# Altium schematic sheet NBP5 Actel ProASIC Plus PQ208 Rev1.01.SchDoc: Actel APA Daughter Board
size C; Organization: Altium Limited; Address1: L3, 12a Rodborough Rd; Address2: Frenchs Forest; Address3: NSW; Address4: Australia 2086; DocumentNumber: 1; Revision: 1.01; SheetNumber: 1; SheetTotal: 1
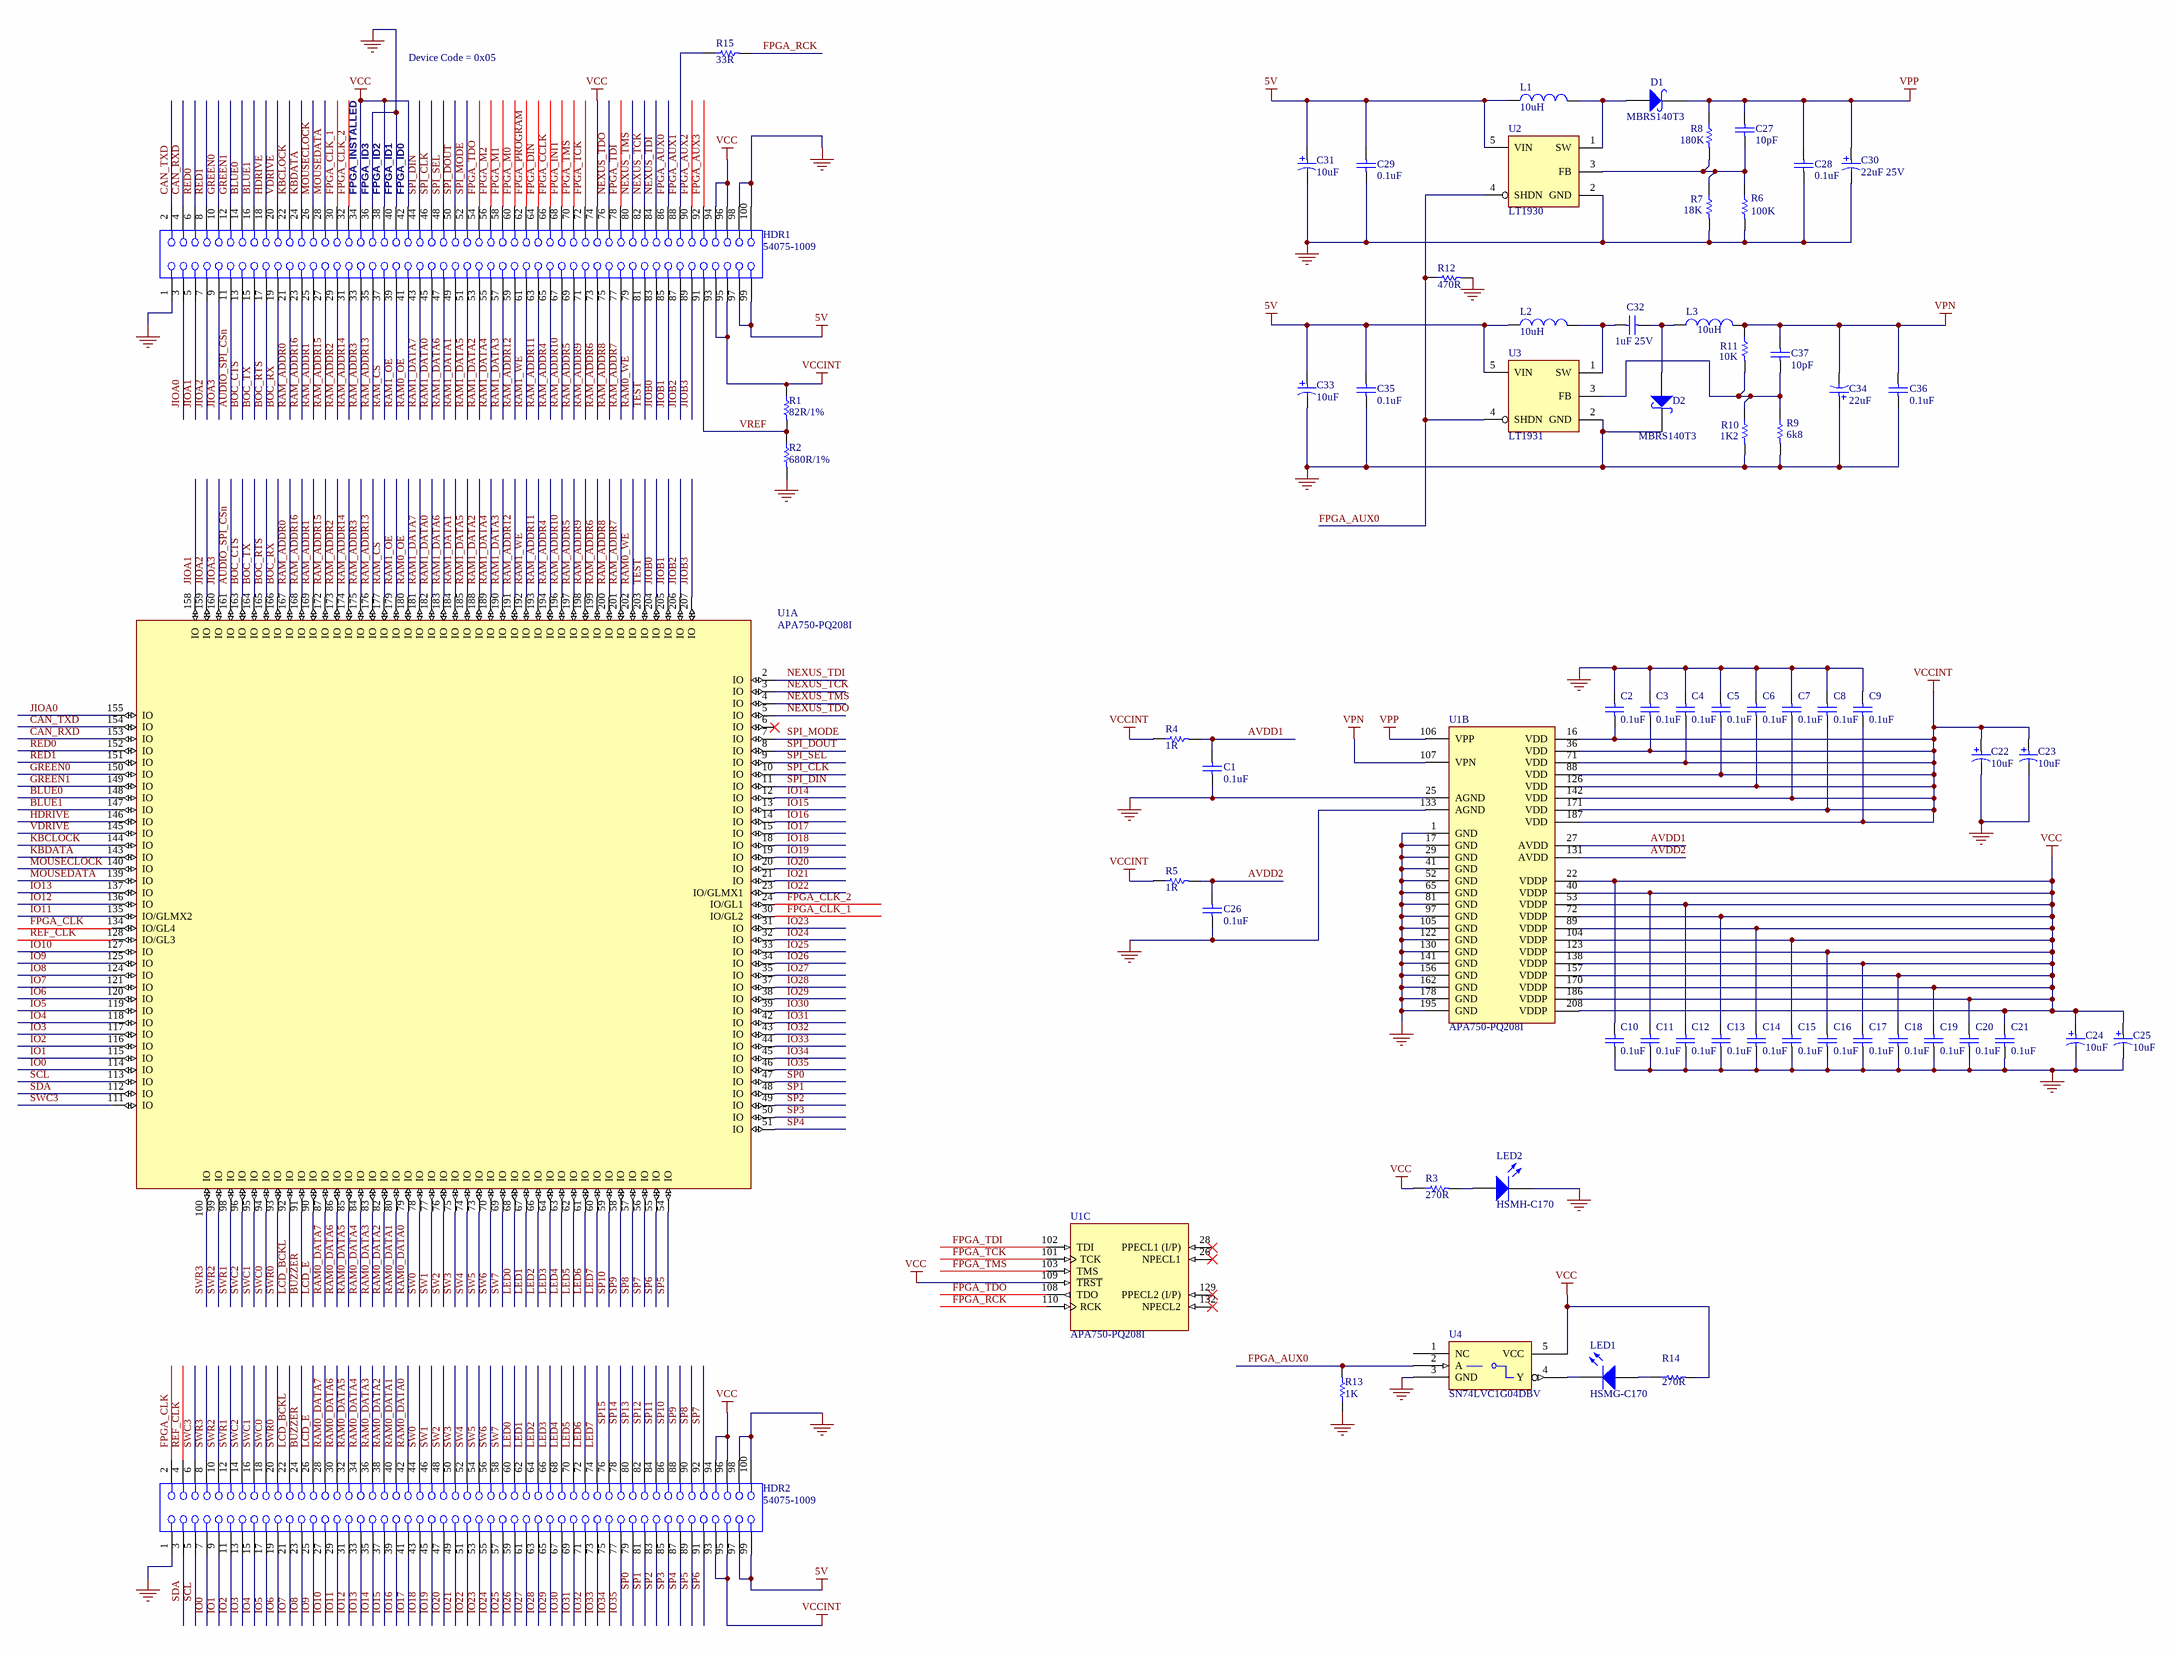
[diagram p0: NBP5 Actel ProASIC Plus PQ208 Rev1.01.SchDoc]

## Parts
C1  0.1uF  [CC2012-0805]
C2  0.1uF  [CC2012-0805]
C3  0.1uF  [CC2012-0805]
C4  0.1uF  [CC2012-0805]
C5  0.1uF  [CC2012-0805]
C6  0.1uF  [CC2012-0805]
C7  0.1uF  [CC2012-0805]
C8  0.1uF  [CC2012-0805]
C9  0.1uF  [CC2012-0805]
C10  0.1uF  [CC2012-0805]
C11  0.1uF  [CC2012-0805]
C12  0.1uF  [CC2012-0805]
C13  0.1uF  [CC2012-0805]
C14  0.1uF  [CC2012-0805]
C15  0.1uF  [CC2012-0805]
C16  0.1uF  [CC2012-0805]
C17  0.1uF  [CC2012-0805]
C18  0.1uF  [CC2012-0805]
C19  0.1uF  [CC2012-0805]
C20  0.1uF  [CC2012-0805]
C21  0.1uF  [CC2012-0805]
C22  10uF  [MCCT-B]
C23  10uF  [MCCT-B]
C24  10uF  [MCCT-B]
C25  10uF  [MCCT-B]
C26  0.1uF  [CC2012-0805]
C27  10pF  [CC2012-0805]
C28  0.1uF  [CC2012-0805]
C29  0.1uF  [CC2012-0805]
C30  22uF 25V  [MCCT-D]
C31  10uF  [MCCT-B]
C32  1uF 25V  [CC3216-1206]
C33  10uF  [MCCT-B]
C34  22uF  [MCCT-D]
C35  0.1uF  [CC2012-0805]
C36  0.1uF  [CC2012-0805]
C37  10pF  [CC2012-0805]
D1  MBRS140T3  [403A]
D2  MBRS140T3  [403A]
HDR1  54075-1009  [54075]
HDR2  54075-1009  [54075]
L1  10uH  [CC4532-1812]
L2  10uH  [CC4532-1812]
L3  10uH  [CC4532-1812]
LED1  HSMG-C170  [SMD _LED]
LED2  HSMH-C170  [SMD _LED]
R1  82R/1%  [CC2012-0805]
R2  680R/1%  [CC2012-0805]
R3  270R  [CC2012-0805]
R4  1R  [CC2012-0805]
R5  1R  [CC2012-0805]
R6  100K  [CC2012-0805]
R7  18K  [CC2012-0805]
R8  180K  [CC2012-0805]
R9  6k8  [CC2012-0805]
R10  1K2  [CC2012-0805]
R11  10K  [CC2012-0805]
R12  470R  [CC2012-0805]
R13  1K  [CC2012-0805]
R14  270R  [CC2012-0805]
R15  33R  [CC2012-0805]
U1  APA750-PQ208I  [PQ208]  (parts A,B,C of 3)
U2  LT1930  [SO-G5/P.95]
U3  LT1931  [SO-G5/P.95]
U4  SN74LVC1G04DBV  [SO-G5/P.95]

## Nets
5V: C29.1 C31.1 C33.1 C35.1 HDR1.97 HDR1.99 HDR2.97 HDR2.99 L1.1 L2.1 U2.5(VIN) U3.5(VIN)
GND: C1.2 C2.1 C3.1 C4.1 C5.1 C6.1 C7.1 C8.1 C9.1 C10.2 C11.1 C12.1 C13.1 C14.1 C15.1 C16.1 C17.1 C18.1 C19.1 C20.1 C21.1 C22.2 C23.2 C24.2 C25.2 C26.2 C28.2 C29.2 C30.2 C31.2 C33.2 C34.1 C35.2 C36.2 D2.2(K) HDR1.1 HDR1.36 HDR1.40 HDR1.98 HDR1.100 HDR2.1 HDR2.98 HDR2.100 LED2.2(K) R2.2 R6.2 R7.2 R9.2 R10.2 R12.2 R13.1 U1.1(GND) U1.17(GND) U1.25(AGND) U1.29(GND) U1.41(GND) U1.52(GND) U1.65(GND) U1.81(GND) U1.97(GND) U1.105(GND) U1.122(GND) U1.130(GND) U1.133(AGND) U1.141(GND) U1.156(GND) U1.162(GND) U1.178(GND) U1.195(GND) U2.2(GND) U3.2(GND) U4.3(GND)
VCC: C10.1 C11.2 C12.2 C13.2 C14.2 C15.2 C16.2 C17.2 C18.2 C19.2 C20.2 C21.2 C24.1 C25.1 HDR1.34 HDR1.38 HDR1.42 HDR1.74 HDR1.94 HDR1.96 HDR2.94 HDR2.96 R3.1 R14.2 U1.22(VDDP) U1.40(VDDP) U1.53(VDDP) U1.72(VDDP) U1.89(VDDP) U1.104(VDDP) U1.109(~{TRST}) U1.123(VDDP) U1.138(VDDP) U1.157(VDDP) U1.170(VDDP) U1.186(VDDP) U1.208(VDDP) U4.5(VCC)
VCCINT: C2.2 C3.2 C4.2 C5.2 C6.2 C7.2 C8.2 C9.2 C22.1 C23.1 HDR1.93 HDR1.95 HDR2.93 HDR2.95 R1.1 R4.1 R5.1 U1.16(VDD) U1.36(VDD) U1.71(VDD) U1.88(VDD) U1.126(VDD) U1.142(VDD) U1.171(VDD) U1.187(VDD)
VPN: C34.2 C36.1 C37.1 L3.2 R11.1 U1.107(VPN)
VPP: C27.1 C28.1 C30.1 D1.2(K) R8.1 U1.106(VPP)
AUDIO_SPI_CSn: HDR1.11 U1.161(IO)
AVDD1: C1.1 R4.2 U1.27(AVDD)
AVDD2: C26.1 R5.2 U1.131(AVDD)
BLUE0: HDR1.14 U1.148(IO)
BLUE1: HDR1.16 U1.147(IO)
BOC_CTS: HDR1.13 U1.163(IO)
BOC_RTS: HDR1.17 U1.165(IO)
BOC_RX: HDR1.19 U1.166(IO)
BOC_TX: HDR1.15 U1.164(IO)
BUZZER: HDR2.24 U1.91(IO)
CAN_RXD: HDR1.4 U1.153(IO)
CAN_TXD: HDR1.2 U1.154(IO)
FPGA_AUX0: HDR1.86 R12.1 R13.2 U2.4(SHDN) U3.4(SHDN) U4.2(A)
FPGA_AUX1: HDR1.88 R15.1
FPGA_AUX2: HDR1.90
FPGA_AUX3: HDR1.92
FPGA_CCLK: HDR1.66
FPGA_CLK: HDR2.2 U1.134(IO/GL4)
FPGA_CLK_1: HDR1.30 U1.30(IO/GL2)
FPGA_CLK_2: HDR1.32 U1.24(IO/GL1)
FPGA_DIN: HDR1.64
FPGA_INIT: HDR1.68
FPGA_M0: HDR1.60
FPGA_M1: HDR1.58
FPGA_M2: HDR1.56
FPGA_PROGRAM: HDR1.62
FPGA_RCK: R15.2 U1.110(RCK)
FPGA_TCK: HDR1.72 U1.101(TCK)
FPGA_TDI: HDR1.78 U1.102(TDI)
FPGA_TDO: HDR1.54 U1.108(TDO)
FPGA_TMS: HDR1.70 U1.103(TMS)
GREEN0: HDR1.10 U1.150(IO)
GREEN1: HDR1.12 U1.149(IO)
HDRIVE: HDR1.18 U1.146(IO)
IO0: HDR2.7 U1.114(IO)
IO1: HDR2.9 U1.115(IO)
IO2: HDR2.11 U1.116(IO)
IO3: HDR2.13 U1.117(IO)
IO4: HDR2.15 U1.118(IO)
IO5: HDR2.17 U1.119(IO)
IO6: HDR2.19 U1.120(IO)
IO7: HDR2.21 U1.121(IO)
IO8: HDR2.23 U1.124(IO)
IO9: HDR2.25 U1.125(IO)
IO10: HDR2.27 U1.127(IO)
IO11: HDR2.29 U1.135(IO/GLMX2)
IO12: HDR2.31 U1.136(IO)
IO13: HDR2.33 U1.137(IO)
IO14: HDR2.35 U1.12(IO)
IO15: HDR2.37 U1.13(IO)
IO16: HDR2.39 U1.14(IO)
IO17: HDR2.41 U1.15(IO)
IO18: HDR2.43 U1.18(IO)
IO19: HDR2.45 U1.19(IO)
IO20: HDR2.47 U1.20(IO)
IO21: HDR2.49 U1.21(IO)
IO22: HDR2.51 U1.23(IO/GLMX1)
IO23: HDR2.53 U1.31(IO)
IO24: HDR2.55 U1.32(IO)
IO25: HDR2.57 U1.33(IO)
IO26: HDR2.59 U1.34(IO)
IO27: HDR2.61 U1.35(IO)
IO28: HDR2.63 U1.37(IO)
IO29: HDR2.65 U1.38(IO)
IO30: HDR2.67 U1.39(IO)
IO31: HDR2.69 U1.42(IO)
IO32: HDR2.71 U1.43(IO)
IO33: HDR2.73 U1.44(IO)
IO34: HDR2.75 U1.45(IO)
IO35: HDR2.77 U1.46(IO)
JIOA0: HDR1.3 U1.155(IO)
JIOA1: HDR1.5 U1.158(IO)
JIOA2: HDR1.7 U1.159(IO)
JIOA3: HDR1.9 U1.160(IO)
JIOB0: HDR1.83 U1.204(IO)
JIOB1: HDR1.85 U1.205(IO)
JIOB2: HDR1.87 U1.206(IO)
JIOB3: HDR1.89 U1.207(IO)
KBCLOCK: HDR1.22 U1.144(IO)
KBDATA: HDR1.24 U1.143(IO)
LCD_BCKL: HDR2.22 U1.92(IO)
LCD_E: HDR2.26 U1.90(IO)
LED0: HDR2.60 U1.68(IO)
LED1: HDR2.62 U1.67(IO)
LED2: HDR2.64 U1.66(IO)
LED3: HDR2.66 U1.64(IO)
LED4: HDR2.68 U1.63(IO)
LED5: HDR2.70 U1.62(IO)
LED6: HDR2.72 U1.61(IO)
LED7: HDR2.74 U1.60(IO)
MOUSECLOCK: HDR1.26 U1.140(IO)
MOUSEDATA: HDR1.28 U1.139(IO)
NEXUS_TCK: HDR1.82 U1.3(IO)
NEXUS_TDI: HDR1.84 U1.2(IO)
NEXUS_TDO: HDR1.76 U1.5(IO)
NEXUS_TMS: HDR1.80 U1.4(IO)
RAM0_DATA0: HDR2.42 U1.79(IO)
RAM0_DATA1: HDR2.40 U1.80(IO)
RAM0_DATA2: HDR2.38 U1.82(IO)
RAM0_DATA3: HDR2.36 U1.83(IO)
RAM0_DATA4: HDR2.34 U1.84(IO)
RAM0_DATA5: HDR2.32 U1.85(IO)
RAM0_DATA6: HDR2.30 U1.86(IO)
RAM0_DATA7: HDR2.28 U1.87(IO)
RAM0_OE: HDR1.41 U1.180(IO)
RAM0_WE: HDR1.79 U1.202(IO)
RAM1_DATA0: HDR1.45 U1.182(IO)
RAM1_DATA1: HDR1.49 U1.184(IO)
RAM1_DATA2: HDR1.53 U1.188(IO)
RAM1_DATA3: HDR1.57 U1.190(IO)
RAM1_DATA4: HDR1.55 U1.189(IO)
RAM1_DATA5: HDR1.51 U1.185(IO)
RAM1_DATA6: HDR1.47 U1.183(IO)
RAM1_DATA7: HDR1.43 U1.181(IO)
RAM1_OE: HDR1.39 U1.179(IO)
RAM1_WE: HDR1.61 U1.192(IO)
RAM_ADDR0: HDR1.21 U1.167(IO)
RAM_ADDR1: HDR1.25 U1.169(IO)
RAM_ADDR2: HDR1.29 U1.173(IO)
RAM_ADDR3: HDR1.33 U1.175(IO)
RAM_ADDR4: HDR1.65 U1.194(IO)
RAM_ADDR5: HDR1.69 U1.197(IO)
RAM_ADDR6: HDR1.73 U1.199(IO)
RAM_ADDR7: HDR1.77 U1.201(IO)
RAM_ADDR8: HDR1.75 U1.200(IO)
RAM_ADDR9: HDR1.71 U1.198(IO)
RAM_ADDR10: HDR1.67 U1.196(IO)
RAM_ADDR11: HDR1.63 U1.193(IO)
RAM_ADDR12: HDR1.59 U1.191(IO)
RAM_ADDR13: HDR1.35 U1.176(IO)
RAM_ADDR14: HDR1.31 U1.174(IO)
RAM_ADDR15: HDR1.27 U1.172(IO)
RAM_ADDR16: HDR1.23 U1.168(IO)
RAM_CS: HDR1.37 U1.177(IO)
RED0: HDR1.6 U1.152(IO)
RED1: HDR1.8 U1.151(IO)
REF_CLK: HDR2.4 U1.128(IO/GL3)
SCL: HDR2.5 U1.113(IO)
SDA: HDR2.3 U1.112(IO)
SP0: HDR2.79 U1.47(IO)
SP1: HDR2.81 U1.48(IO)
SP2: HDR2.83 U1.49(IO)
SP3: HDR2.85 U1.50(IO)
SP4: HDR2.87 U1.51(IO)
SP5: HDR2.89 U1.54(IO)
SP6: HDR2.91 U1.55(IO)
SP7: HDR2.92 U1.56(IO)
SP8: HDR2.90 U1.57(IO)
SP9: HDR2.88 U1.58(IO)
SP10: HDR2.86 U1.59(IO)
SP11: HDR2.84
SP12: HDR2.82
SP13: HDR2.80
SP14: HDR2.78
SP15: HDR2.76
SPI_CLK: HDR1.46 U1.10(IO)
SPI_DIN: HDR1.44 U1.11(IO)
SPI_DOUT: HDR1.50 U1.8(IO)
SPI_MODE: HDR1.52 U1.7(IO)
SPI_SEL: HDR1.48 U1.9(IO)
SW0: HDR2.44 U1.78(IO)
SW1: HDR2.46 U1.77(IO)
SW2: HDR2.48 U1.76(IO)
SW3: HDR2.50 U1.75(IO)
SW4: HDR2.52 U1.74(IO)
SW5: HDR2.54 U1.73(IO)
SW6: HDR2.56 U1.70(IO)
SW7: HDR2.58 U1.69(IO)
SWC0: HDR2.18 U1.94(IO)
SWC1: HDR2.16 U1.95(IO)
SWC2: HDR2.14 U1.96(IO)
SWC3: HDR2.6 U1.111(IO)
SWR0: HDR2.20 U1.93(IO)
SWR1: HDR2.12 U1.98(IO)
SWR2: HDR2.10 U1.99(IO)
SWR3: HDR2.8 U1.100(IO)
TEST: HDR1.81 U1.203(IO)
VDRIVE: HDR1.20 U1.145(IO)
VREF: HDR1.91 R1.2 R2.1
NetC27_2: C27.2 R6.1 R7.1 R8.2 U2.3(FB)
NetC32_1: C32.1 L2.2 U3.1(SW)
NetC32_2: C32.2 D2.1(A) L3.1
NetC37_2: C37.2 R9.1 R10.1 R11.2 U3.3(FB)
NetD1_1: D1.1(A) L1.2 U2.1(SW)
NetLED1_1: LED1.1(A) R14.1
NetLED1_2: LED1.2(K) U4.4(Y)
NetLED2_1: LED2.1(A) R3.2

Not connected (* = marked no-connect by the designer): U1 6(IO)* 26(NPECL1)* 28(PPECL1_(I/P))* 129(PPECL2_(I/P))* 132(NPECL2)*; U4 1(NC)

## Notes on the sheet
- Device Code = 0x05
- (near HDR1) FPGA_INSTALLED
- (near HDR1) FPGA_ID3
- (near HDR1) FPGA_ID2
- (near HDR1) FPGA_ID1
- (near HDR1) FPGA_ID0
- Title
- Size:
- Date:
- File:
- C
- Number:
- Time:
- Revision:
- Sheet
- of

## Library data of the parts
C1-C21 C26-C29 C32 C35-C37 = CAP: Capacitor
C22-C25 C30 C31 C33 C34 = CAP_POLAR: Polar Capacitor
  C30 C31 C33 C34: Supplier Code: FARNELL 197520
D1 D2 = Shottky: Shottky Diode
HDR1 HDR2 = 54075-1009: Board-to-Board, Docking Station, 0.80mm (.031") Pitch, Shielded Receptacle, Vertical, Ultra Low Profile, SMT; Manufacturer: Molex; Package Information: Latest Revision: Jun-2001; Mating Height: 8.5mm; Voltage: 100V; Current: 0.5A; Contact Resistance: 40mOhm max; PCB Layout: Complies with Manufacturer's Recommendation.; Published: 15-Oct-2003; Datasheet: Latest Revision: Feb-2002; Package Reference: 54075; Publisher: Altium Limited
L1-L3 = INDUCTOR
LED1 LED2 = HSMX-C670: Typical RED GaAs SMD LED Agilent make; Manufacturer: Generic Components; Class I: Optoelectronic; Fitted: True; Published: 8-Jun-2000; Revision: July-2002: Re-released for DXP Platform.; Publisher: Altium Limited; Class II: LED
R1-R15 = RES: Resistor
U1 = APA750-PQ208I: ProASICPlus APA750 Flash FPGA, 156 User IOs, 208-Pin PQFP, Speed Grade Standard, Industrial Grade; Package Information: Latest Revision: ver8.2, Jun-2003; PECL Pins: If unused, leave unconnected.; Code - JEDEC: MS-029-FA-1; Published: 21-May-2003; Datasheet: Latest Revision: Oct-2003; Package Reference: PQ208; Publisher: Altium Limited
U2 = LT1930: Switching Regulator; Manufacturer: Linear Technology
U3 = LT1931: Switching Regulator; Manufacturer: Linear Technology
U4 = SN74AHC1G04DBVR: Manufacturer: TI; Fitted: True